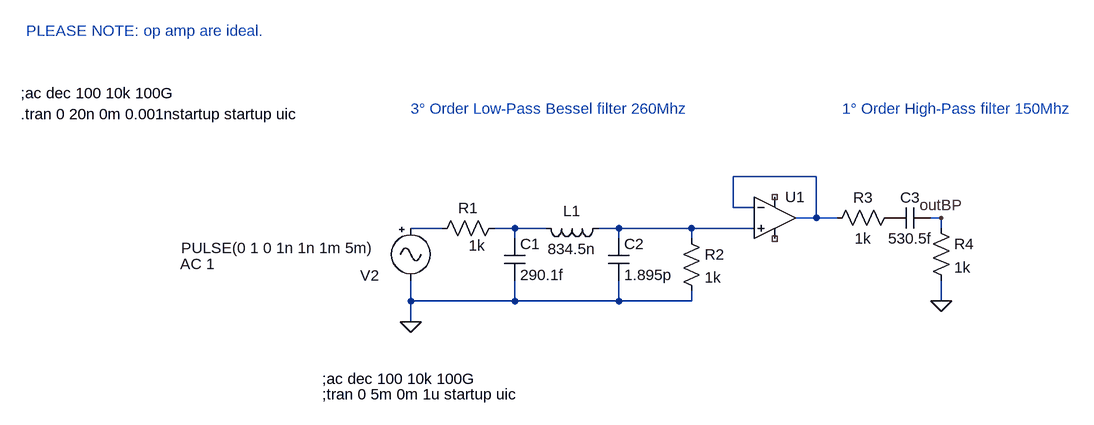
[diagram p0: schematic Passive_3_LP_Bessel_1_HP.asc]
Passive_3_LP_Bessel_1_HP.asc, the LTspice schematic file:
Version 4
SHEET 1 1100 680
WIRE 544 -32 416 -32
WIRE 416 16 416 -32
WIRE 448 16 416 16
WIRE 544 32 544 -32
WIRE 544 32 512 32
WIRE 576 32 544 32
WIRE 736 32 720 32
WIRE -32 48 -80 48
WIRE 80 48 48 48
WIRE 128 48 80 48
WIRE 240 48 208 48
WIRE 352 48 240 48
WIRE 448 48 352 48
WIRE 736 48 736 32
WIRE 80 64 80 48
WIRE 240 64 240 48
WIRE 352 64 352 48
WIRE -80 160 -80 128
WIRE 80 160 80 128
WIRE 80 160 -80 160
WIRE 240 160 240 128
WIRE 240 160 80 160
WIRE 352 160 352 144
WIRE 352 160 240 160
WIRE 736 160 736 128
WIRE -80 192 -80 160
FLAG 736 160 0
FLAG -80 192 0
FLAG 736 32 outBP
SYMBOL res 64 32 R90
WINDOW 0 0 56 VBottom 2
WINDOW 3 27 42 VTop 2
SYMATTR InstName R1
SYMATTR Value 1k
SYMBOL cap 64 64 R0
SYMATTR InstName C1
SYMATTR Value 290.1f
SYMBOL ind 224 32 R90
WINDOW 0 5 56 VBottom 2
WINDOW 3 32 56 VTop 2
SYMATTR InstName L1
SYMATTR Value 834.5n
SYMBOL cap 224 64 R0
SYMATTR InstName C2
SYMATTR Value 1.895p
SYMBOL res 336 48 R0
SYMATTR InstName R2
SYMATTR Value 1k
SYMBOL OpAmps\\UniversalOpamp2 480 32 R0
SYMATTR InstName U1
SYMATTR SpiceModel level1
SYMATTR Value2 Avol=100G GBW=10000G Slew=1000G
SYMATTR SpiceLine2 En=0 Enk=0 In=0 Ink=0 Rin=500Meg Ro=50 Ccm=1f Cdiff=1f
SYMBOL res 672 16 R90
WINDOW 0 0 56 VBottom 2
WINDOW 3 32 56 VTop 2
SYMATTR InstName R3
SYMATTR Value 1k
SYMBOL cap 720 16 R90
WINDOW 0 0 32 VBottom 2
WINDOW 3 32 32 VTop 2
SYMATTR InstName C3
SYMATTR Value 530.5f
SYMBOL res 720 32 R0
SYMATTR InstName R4
SYMATTR Value 1k
SYMBOL Misc\\signal -80 32 R0
WINDOW 3 -353 46 Left 2
WINDOW 123 -355 71 Left 2
WINDOW 39 0 0 Left 0
WINDOW 0 -78 89 Left 2
SYMATTR Value PULSE(0 1 0 1n 1n 1m 5m)
SYMATTR Value2 AC 1
SYMATTR InstName V2
TEXT -216 280 Left 2 !;ac dec 100 10k 100G
TEXT -216 304 Left 2 !;tran 0 5m 0m 1u startup uic
TEXT -680 -160 Left 2 !;ac dec 100 10k 100G
TEXT -680 -128 Left 2 !.tran 0 20n 0m 0.001nstartup startup uic
TEXT -80 -136 Left 2 ;3° Order Low-Pass Bessel filter 260Mhz
TEXT 584 -136 Left 2 ;1° Order High-Pass filter 150Mhz
TEXT -672 -256 Left 2 ;PLEASE NOTE: op amp are ideal.

The netlist it stands for:
* Passive_3_LP_Bessel_1_HP.asc
R1 N003 N002 1k
C1 N003 0 290.1f
L1 N004 N003 834.5n
C2 N004 0 1.895p
R2 N004 0 1k
XU1 N004 N001 NC_01 NC_02 N001 level1 Avol=100G GBW=10000G Slew=1000G Ilimit=25m Rail=0 Vos=0 En=0 Enk=0 In=0 Ink=0 Rin=500Meg Ro=50 Ccm=1f Cdiff=1f  ; pins In+ In- V+ V- OUT
R3 P001 N001 1k
C3 outBP P001 530.5f
R4 outBP 0 1k
V2 N002 0 PULSE(0 1 0 1n 1n 1m 5m) AC 1
;ac dec 100 10k 100G
;tran 0 5m 0m 1u startup uic
;ac dec 100 10k 100G
.tran 0 20n 0m 0.001nstartup startup uic
* 3° Order Low-Pass Bessel filter 260Mhz
* 1° Order High-Pass filter 150Mhz
* PLEASE NOTE: op amp are ideal.
.lib UniversalOpAmp2.lib
.backanno
.end